# Altium schematic sheet 07_ISP.SchDoc: SPCA2688 ISP
size C; DocumentNumber: 9; SheetNumber: 9; SheetTotal: 12
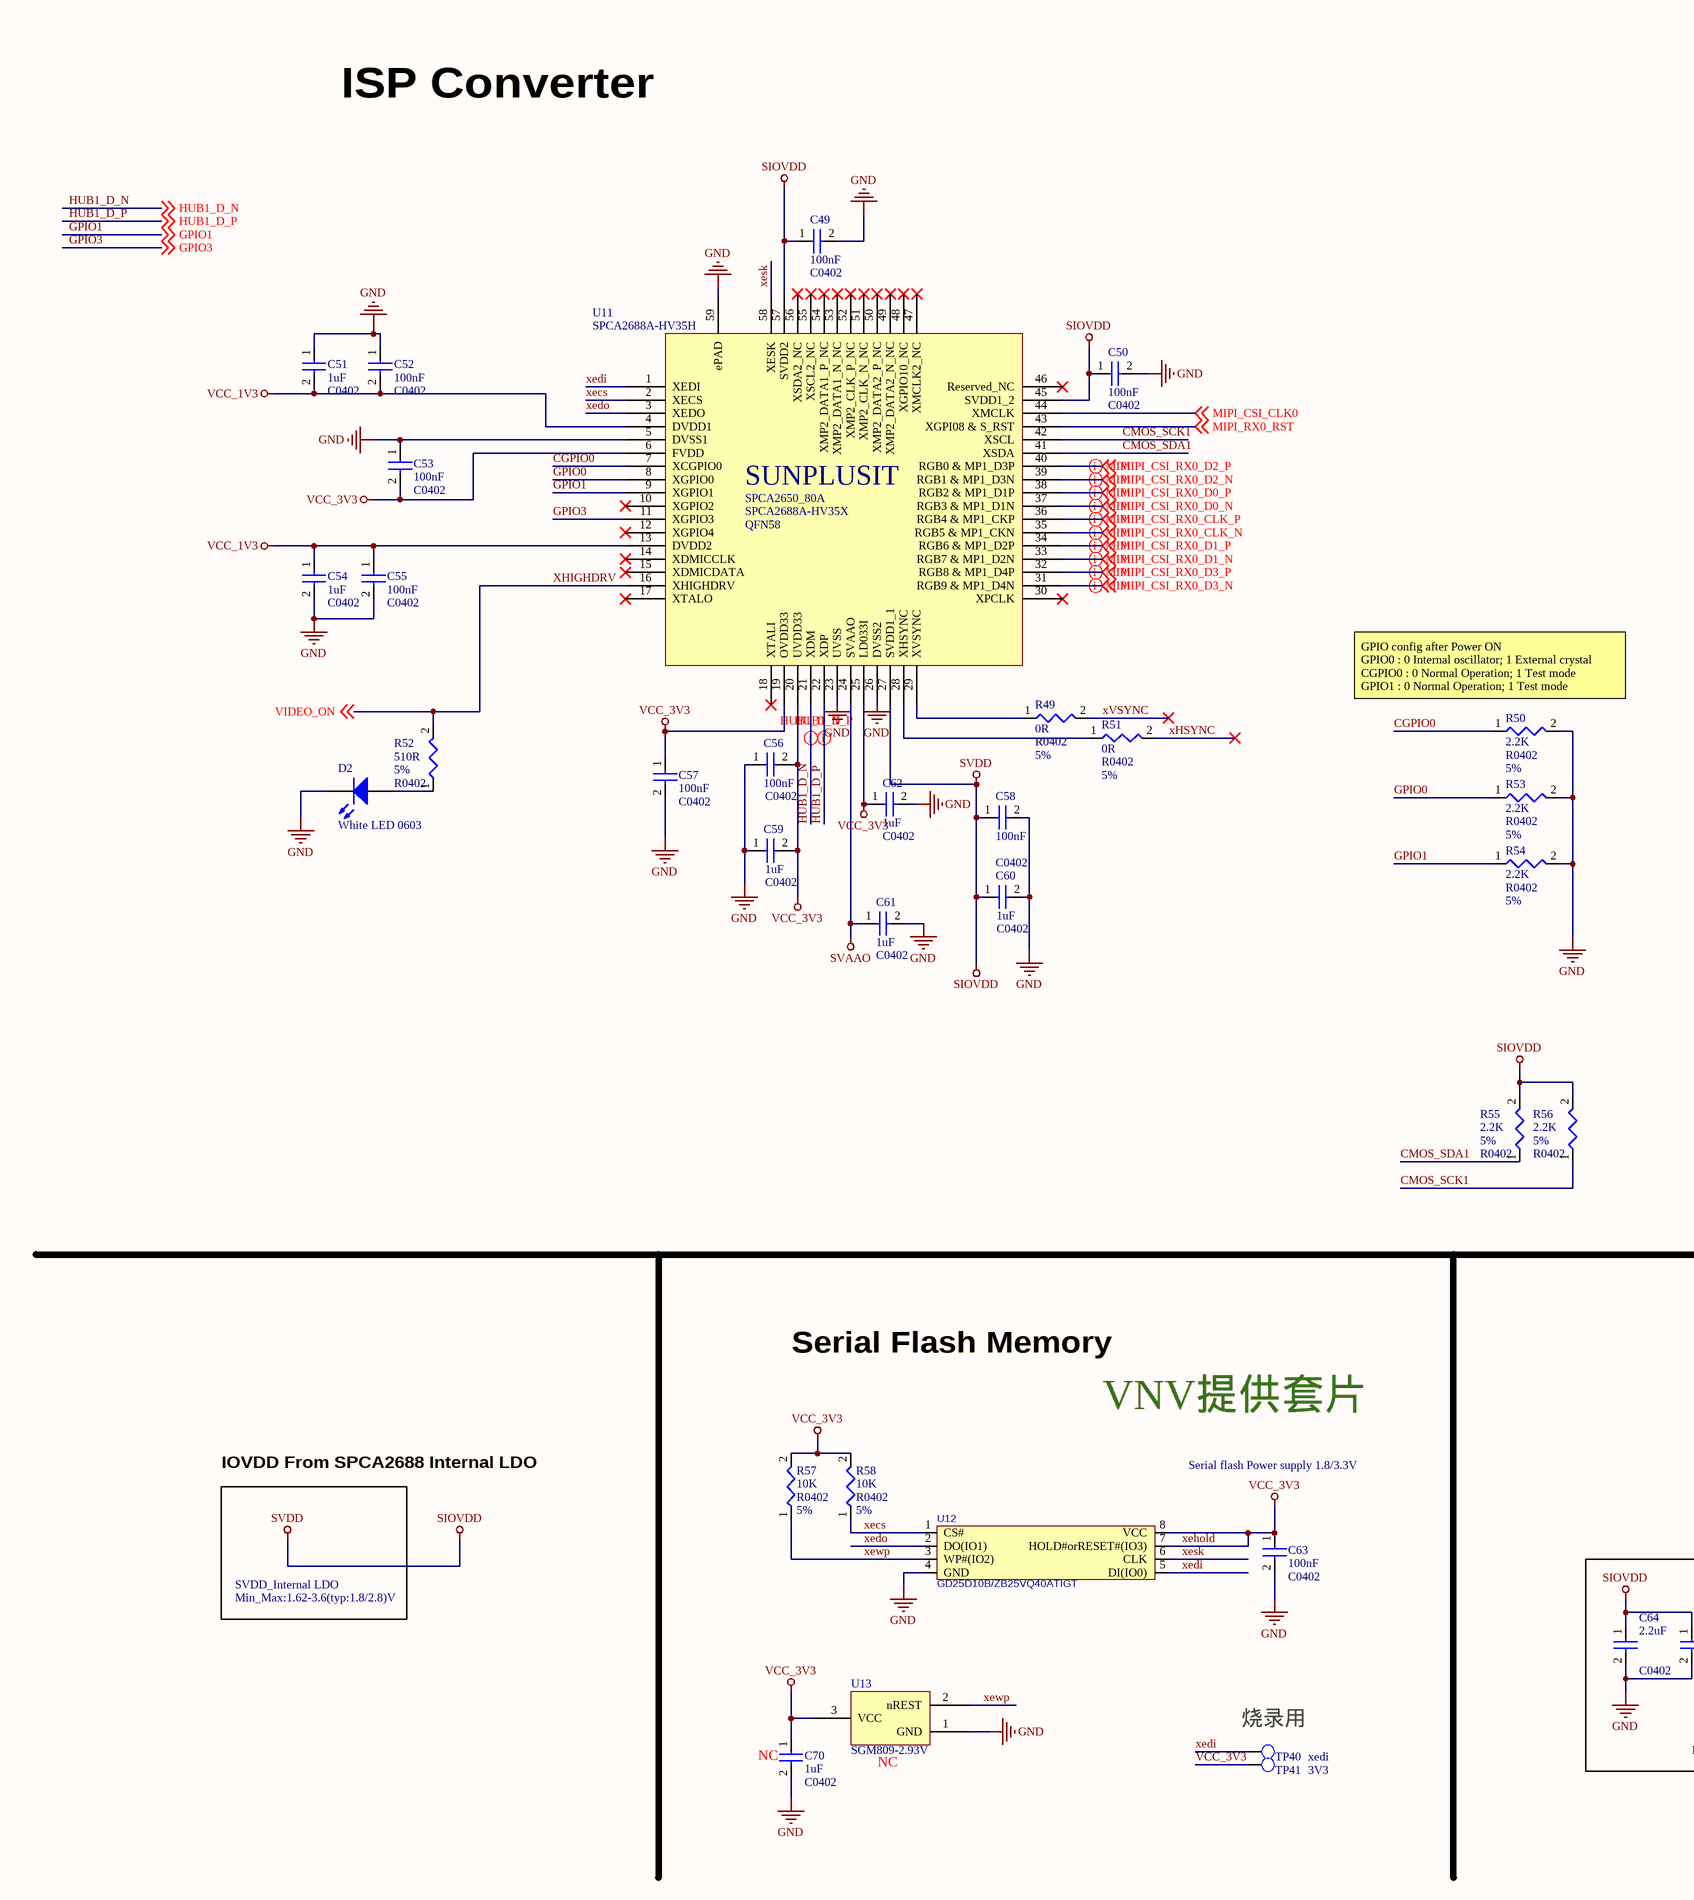
[diagram p0: 07_ISP.SchDoc, left]
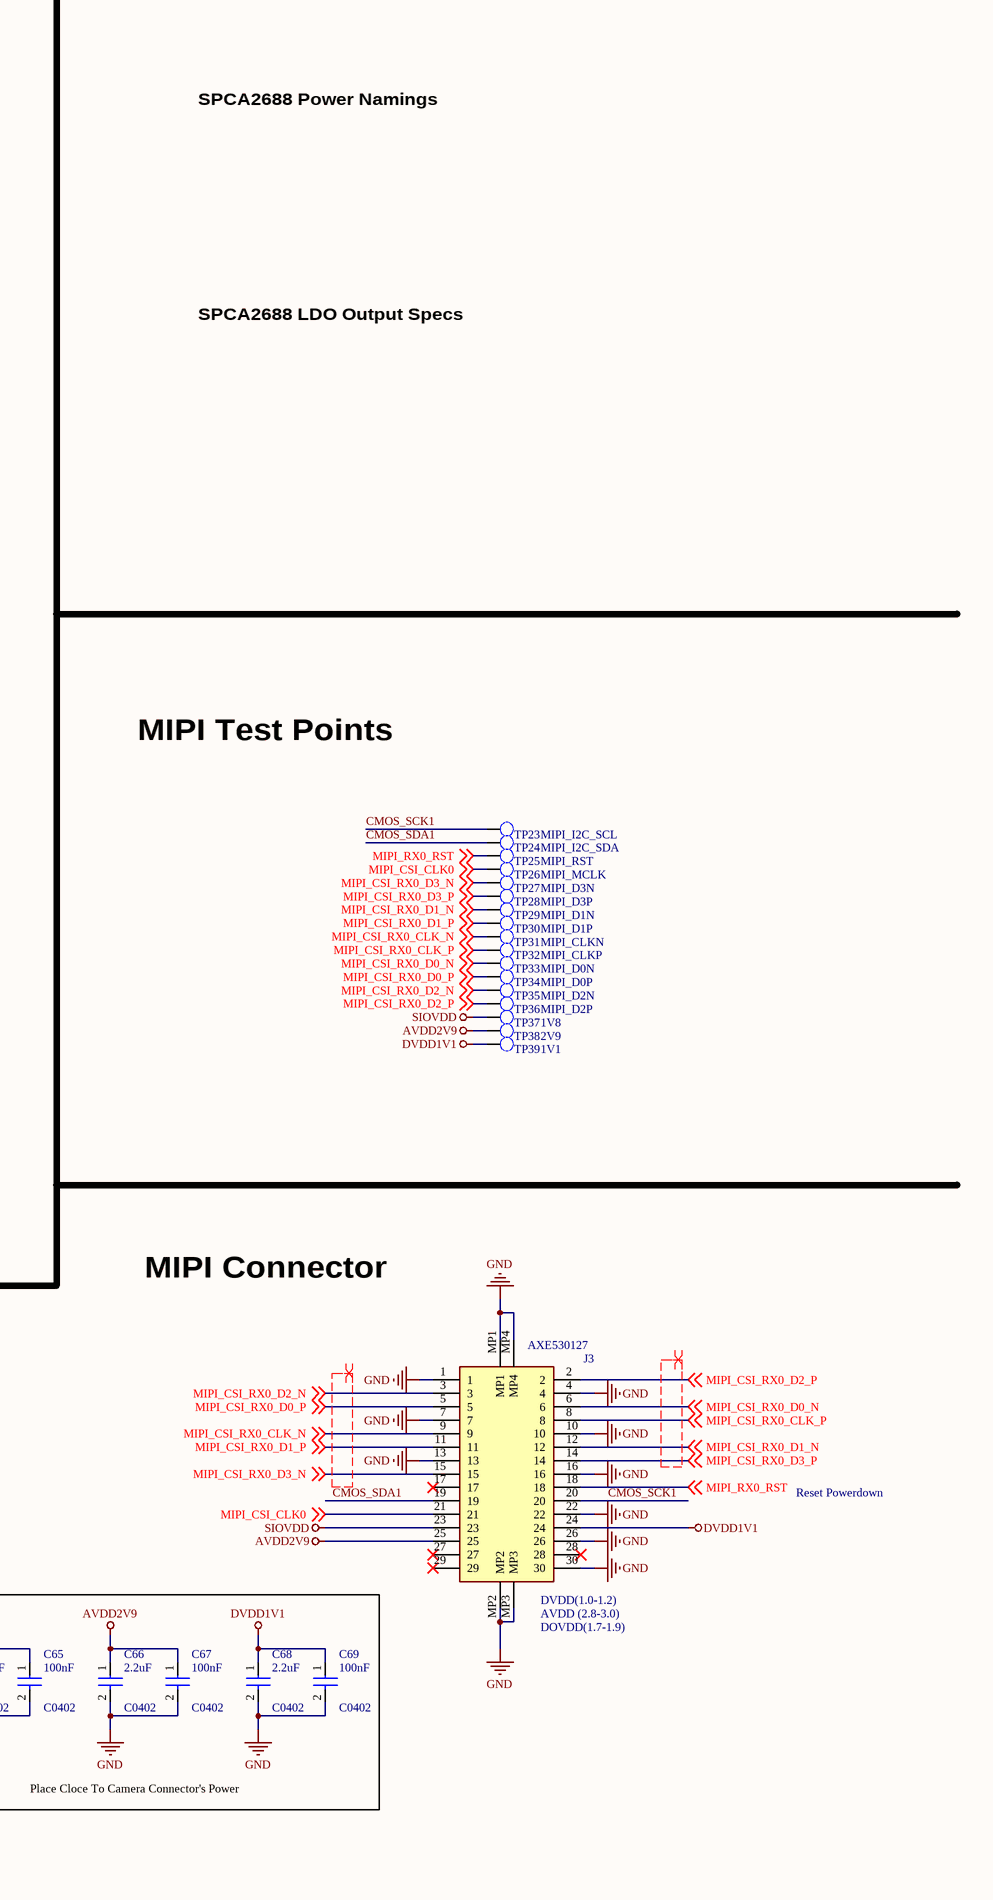
[diagram p1: 07_ISP.SchDoc, right]

## Parts
C49  100nF  PCB Footprint: C0402  [C0402_L]
C50  100nF  PCB Footprint: C0402  [C0402_L]
C51  1uF  PCB Footprint: C0402  [C0402_L]
C52  100nF  PCB Footprint: C0402  [C0402_L]
C53  100nF  PCB Footprint: C0402  [C0402_L]
C54  1uF  PCB Footprint: C0402  [C0402_L]
C55  100nF  PCB Footprint: C0402  [C0402_L]
C56  100nF  PCB Footprint: C0402  [C0402_L]
C57  100nF  PCB Footprint: C0402  [C0402_L]
C58  100nF  PCB Footprint: C0402  [C0402_L]
C59  1uF  PCB Footprint: C0402  [C0402_L]
C60  1uF  PCB Footprint: C0402  [C0402_L]
C61  1uF  PCB Footprint: C0402  [C0402_L]
C62  1uF  PCB Footprint: C0402  [C0402_L]
C63  100nF  PCB Footprint: C0402  [C0402_L]
C64  2.2uF  PCB Footprint: C0402  [C0402_L]
C65  100nF  PCB Footprint: C0402  [C0402_L]
C66  2.2uF  PCB Footprint: C0402  [C0402_L]
C67  100nF  PCB Footprint: C0402  [C0402_L]
C68  2.2uF  PCB Footprint: C0402  [C0402_L]
C69  100nF  PCB Footprint: C0402  [C0402_L]
C70  1uF  PCB Footprint: C0402  [C0402_L]
D2  White LED 0603  [LED0603_W]
J3  AXE530127  [AXE530127_counterclock_pin]
R49  0R  Tolerance: 5%  [R0402]  (net tie, no BOM)
R50  2.2K  Tolerance: 5%  [R0402]
R51  0R  Tolerance: 5%  [R0402]  (net tie, no BOM)
R52  510R  Tolerance: 5%  [R0402]
R53  2.2K  Tolerance: 5%  [R0402]
R54  2.2K  Tolerance: 5%  [R0402]
R55  2.2K  Tolerance: 5%  [R0402]
R56  2.2K  Tolerance: 5%  [R0402]
R57  10K  Tolerance: 5%  [R0402]
R58  10K  Tolerance: 5%  [R0402]
TP23  MIPI_I2C_SCL  [TP_0R70]  (no BOM)
TP24  MIPI_I2C_SDA  [TP_0R70]  (no BOM)
TP25  MIPI_RST  [TP_0R70]  (no BOM)
TP26  MIPI_MCLK  [TP_0R70]  (no BOM)
TP27  MIPI_D3N  [TP_0R70]  (no BOM)
TP28  MIPI_D3P  [TP_0R70]  (no BOM)
TP29  MIPI_D1N  [TP_0R70]  (no BOM)
TP30  MIPI_D1P  [TP_0R70]  (no BOM)
TP31  MIPI_CLKN  [TP_0R70]  (no BOM)
TP32  MIPI_CLKP  [TP_0R70]  (no BOM)
TP33  MIPI_D0N  [TP_0R70]  (no BOM)
TP34  MIPI_D0P  [TP_0R70]  (no BOM)
TP35  MIPI_D2N  [TP_0R70]  (no BOM)
TP36  MIPI_D2P  [TP_0R70]  (no BOM)
TP37  1V8  [TP_0R70]  (no BOM)
TP38  2V9  [TP_0R70]  (no BOM)
TP39  1V1  [TP_0R70]  (no BOM)
TP40  xedi  [TP_0R70]  (no BOM)
TP41  3V3  [TP_0R70]  (no BOM)
U11  SPCA2688A-HV35H  [SPCA2680A_QFN58]
U12  GD25D10B/ZB25VQ40ATIGT  [SOIC-8]
U13  SGM809-2.93V  [SOT23]  (net tie, no BOM)

## Blocks framed on the sheet
Place Cloce To Camera Connector's Power: C64-C69

## Nets
AVDD2V9: C66.1 C67.1 J3.25 TP38.1
DVDD1V1: C68.1 C69.1 J3.24 TP39.1
GND: C49.2 C50.2 C51.1 C52.1 C53.1 C54.2 C55.2 C56.1 C57.2 C58.2 C59.1 C60.2 C61.2 C62.2 C63.2 C64.2 C65.2 C66.2 C67.2 C68.2 C69.2 C70.2 D2.2(K) J3.1 J3.4 J3.7 J3.10 J3.13 J3.16 J3.22 J3.26 J3.30 J3.MP1 J3.MP2 J3.MP3 J3.MP4 R50.2 R53.2 R54.2 U11.5(DVSS1) U11.23(UVSS) U11.26(DVSS2) U11.59(ePAD) U12.4(GND) U13.1(GND)
SIOVDD: C49.1 C50.1 C58.1 C60.1 C64.1 C65.1 J3.23 R55.2 R56.2 TP37.1 U11.27(SVDD1_1) U11.45(SVDD1_2) U11.57(SVDD2)  [also labelled SVDD]
SVAAO: C61.1 U11.24(SVAAO)
VCC_1V3: C51.2 C52.2 C54.1 C55.1 U11.4(DVDD1) U11.13(DVDD2)
VCC_3V3: C53.2 C56.2 C57.1 C59.2 C62.1 C63.1 C70.1 R57.2 R58.2 TP41.1 U11.6(FVDD) U11.19(OVDD33) U11.20(UVDD33) U11.25(LD033I) U12.7(HOLD#orRESET#(IO3)) U12.8(VCC) U13.3(VCC)  [also labelled xehold]
CGPIO0: R50.1 U11.7(XCGPIO0)
CMOS_SCK1: J3.20 R56.1 TP23.1 U11.42(XSCL)
CMOS_SDA1: J3.19 R55.1 TP24.1 U11.41(XSDA)
GPIO0: R53.1 U11.8(XGPIO0)
GPIO1: R54.1 U11.9(XGPIO1) ; off-sheet GPIO1
GPIO3: U11.11(XGPIO3) ; off-sheet GPIO3
HUB1_D_N: U11.21(XDM) ; off-sheet HUB1_D_N
HUB1_D_P: U11.22(XDP) ; off-sheet HUB1_D_P
MIPI_CSI_CLK0: J3.21 TP26.1 U11.44(XMCLK) ; off-sheet MIPI_CSI_CLK0
MIPI_CSI_RX0_CLK_N: J3.9 TP31.1 U11.35(RGB5_&_MP1_CKN) ; off-sheet MIPI_CSI_RX0_CLK_N
MIPI_CSI_RX0_CLK_P: J3.8 TP32.1 U11.36(RGB4_&_MP1_CKP) ; off-sheet MIPI_CSI_RX0_CLK_P
MIPI_CSI_RX0_D0_N: J3.6 TP33.1 U11.37(RGB3_&_MP1_D1N) ; off-sheet MIPI_CSI_RX0_D0_N
MIPI_CSI_RX0_D0_P: J3.5 TP34.1 U11.38(RGB2_&_MP1_D1P) ; off-sheet MIPI_CSI_RX0_D0_P
MIPI_CSI_RX0_D1_N: J3.12 TP29.1 U11.33(RGB7_&_MP1_D2N) ; off-sheet MIPI_CSI_RX0_D1_N
MIPI_CSI_RX0_D1_P: J3.11 TP30.1 U11.34(RGB6_&_MP1_D2P) ; off-sheet MIPI_CSI_RX0_D1_P
MIPI_CSI_RX0_D2_N: J3.3 TP35.1 U11.39(RGB1_&_MP1_D3N) ; off-sheet MIPI_CSI_RX0_D2_N
MIPI_CSI_RX0_D2_P: J3.2 TP36.1 U11.40(RGB0_&_MP1_D3P) ; off-sheet MIPI_CSI_RX0_D2_P
MIPI_CSI_RX0_D3_N: J3.15 TP27.1 U11.31(RGB9_&_MP1_D4N) ; off-sheet MIPI_CSI_RX0_D3_N
MIPI_CSI_RX0_D3_P: J3.14 TP28.1 U11.32(RGB8_&_MP1_D4P) ; off-sheet MIPI_CSI_RX0_D3_P
MIPI_RX0_RST: J3.18 TP25.1 U11.43(XGPI08_&_S_RST) ; off-sheet MIPI_RX0_RST
xecs: R58.1 U11.2(XECS) U12.1(CS#)
xedi: TP40.1 U11.1(XEDI) U12.5(DI(IO0))
xedo: U11.3(XEDO) U12.2(DO(IO1))
xesk: U11.58(XESK) U12.6(CLK)
xewp: R57.1 U12.3(WP#(IO2)) U13.2(nREST)
XHIGHDRV: R52.2 U11.16(XHIGHDRV) ; off-sheet VIDEO_ON  [also labelled VIDEO_ON]
xHSYNC: R51.2
xVSYNC: R49.2
NetD2_1: D2.1(A) R52.1
NetR49_1: R49.1 U11.29(XVSYNC)
NetR51_1: R51.1 U11.28(XHSYNC)

Not connected (* = marked no-connect by the designer): J3 17* 27* 28* 29*; U11 10(XGPIO2)* 12(XGPIO4)* 14(XDMICCLK)* 15(XDMICDATA)* 17(XTALO)* 18(XTALI)* 30(XPCLK)* 46(Reserved_NC)* 47(XMCLK2_NC)* 48(XGPIO10_NC)* 49(XMP2_DATA2_N_NC)* 50(XMP2_DATA2_P_NC)* 51(XMP2_CLK_N_NC)* 52(XMP2_CLK_P_NC)* 53(XMP2_DATA1_N_NC)* 54(XMP2_DATA1_P_NC)* 55(XSCL2_NC)* 56(XSDA2_NC)*

## Layout directives
differential pair; differential pair class USB; net class USB: HUB1_D_N, HUB1_D_P
differential pair; net class MIPI; differential pair class MIPI: MIPI_CSI_RX0_CLK_N, MIPI_CSI_RX0_CLK_P, MIPI_CSI_RX0_D0_N, MIPI_CSI_RX0_D0_P, MIPI_CSI_RX0_D1_N, MIPI_CSI_RX0_D1_P, MIPI_CSI_RX0_D2_N, MIPI_CSI_RX0_D2_P, MIPI_CSI_RX0_D3_N, MIPI_CSI_RX0_D3_P
differential pair: (no net found under the mark)

## Notes on the sheet
- SPCA2688 Power Namings
- ISP Converter
- SPCA2688 LDO Output Specs
- (near R50) GPIO config after Power ON
  GPIO0 : 0 Internal oscillator; 1 External crystal
  CGPIO0 : 0 Normal Operation; 1 Test mode
  GPIO1 : 0 Normal Operation; 1 Test mode
- MIPI Test Points
- MIPI Connector
- Serial Flash Memory
- VNV提供套片
- IOVDD From SPCA2688 Internal LDO
- Serial flash Power supply 1.8/3.3V
- Reset Powerdown
- SVDD_Internal LDO
- Min_Max:1.62-3.6(typ:1.8/2.8)V
- (near J3) DVDD(1.0-1.2)
- (near J3) AVDD (2.8-3.0)
- (near J3) DOVDD(1.7-1.9)
- 烧录用
- (near C70) NC
- (near U13) NC
- Title
- Size:
- Date:
- File:
- C
- Number:
- Time:
- Revision:
- Sheet
- of
- Author: Edward Lai
- Email: edward@vibe.us
- Vibe Inc
- Hangzhou
- vibe.us <http://vibe.us>
- (in symbol SPCA2688A-HV35H) SUNPLUSIT; SPCA2650_80A; SPCA2688A-HV35X; QFN58

## Library data of the parts
C49 C50 C52 C55 C56 C58 C65 C67 C69 = CAP NP_Dup1: cap,100.00nF,+/-10%,25V,X5R,C0402; Priority: A; Part Type: C0402
C51 C54 C59-C61 = CAP NP_Dup1: cap,1.00uF,+/-10%,10V,X5R,C0402; Priority: A; Part Type: C0402
C53 C57 C63 = CAP NP_Dup1: cap,1.0uF,+/-10%,6.3V,C0402; Priority: A; Part Type: C0402
C62 = CAP NP_Dup1: cap,1uF,+/-10%,25V,X5R,C0402; Priority: A; Part Type: C0402
C64 C66 C68 = CAP NP_Dup1: cap,2.20uF,+/-10%,10V,X5R,C0402; Priority: A; Part Type: C0402
C70 = CAP NP_Dup1: cap,1.0uF,+/-10%,6.3V,X5R,C0402; Priority: A; Part Type: C0402
D2 = LED: LED 0603 Wite 发光二极管; Part Type: SS14
J3 = AXE530127: AXE530127 Connector; Manufacturer_Name: Panasonic; Datasheet Link: https://componentsearchengine.com//AXE530127.pdf; Height: 0.97mm; Mouser2 Part Number: 679-AXE530127; Mouser2 Price/Stock: https://www.mouser.com/Search/Refine.aspx?Keyword=679-AXE530127; Manufacturer_Part_Number: AXE530127
R49 R51 = RESISTOR: 通用厚膜电阻,0R,+/-5%,R0402; Priority: A; PCB Footprint: R0402; Part Type: 通用厚膜电阻
  R51: NO BOM: *
R50 R53-R56 = RESISTOR: 通用厚膜电阻,2.2K,+/-5%,R0402; Priority: A; PCB Footprint: R0402; Part Type: 通用厚膜电阻
R52 = RESISTOR: 通用厚膜电阻,510R,+/-5%,R0402; Priority: A; PCB Footprint: R0402; Part Type: 通用厚膜电阻
R57 R58 = RESISTOR: 通用厚膜电阻,10K,+/-5%,R0402; Priority: A; PCB Footprint: R0402; Part Type: 通用厚膜电阻
TP23-TP41 = TP: Test Point 0.7mm; PCB Footprint: TP_0R50; Priority: A; Part Type: TP
U11 = SPCA2688A-HV35H: SPCA2688A-HV35H ISP IC / QFN58 0.4MM
U12 = GD25D10B: SPI FLASH SOP-8
U13 = SGM809-2.93V: SGM809-2.93V SOT-23-3/SOT-23 / Microprocessor Supervisory Circuit / Power on Reset